# Altium project MicroLPR_DSP.PrjPcb
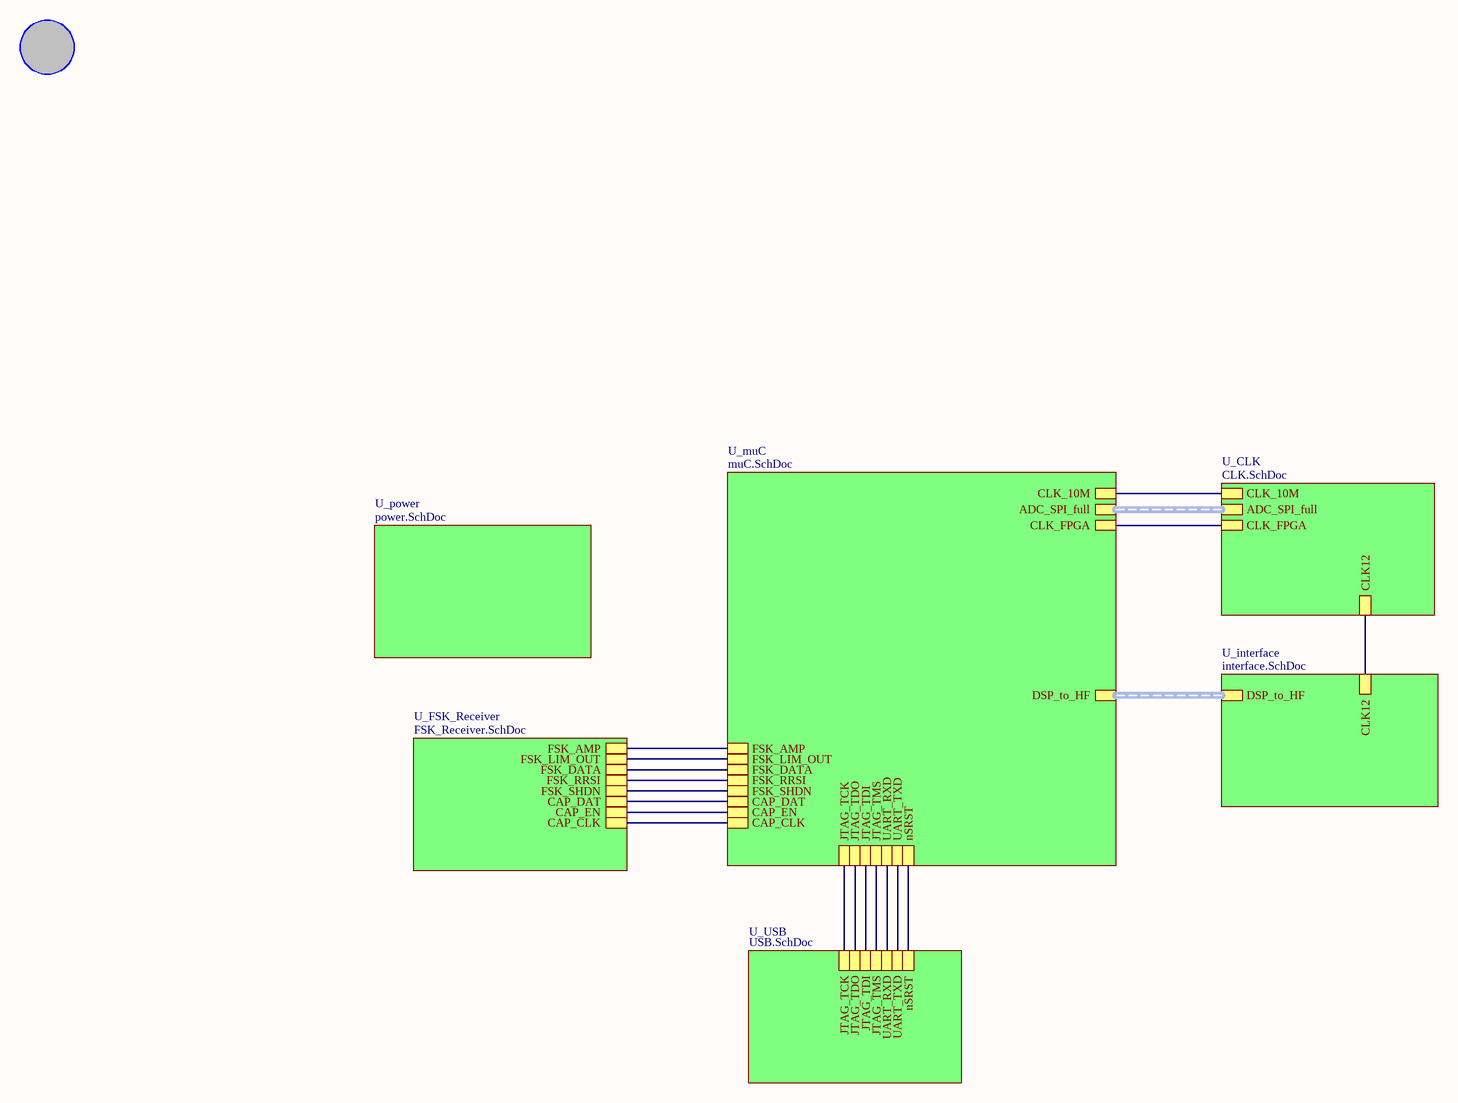
[diagram p0: toplvl.SchDoc]
Version: v1.11; PLB: PLB102241; Date: D705
7 sheets, 185 parts. Net scope: hierarchical (ports join the sheet entries above them; power ports are global).
Board file: MicroLPR_DSP.PcbDoc
Sheets:
  toplvl.SchDoc
    U_power = power.SchDoc
    U_interface = interface.SchDoc
    U_muC = muC.SchDoc
    U_USB = USB.SchDoc
    U_FSK_Receiver = FSK_Receiver.SchDoc
    U_CLK = CLK.SchDoc

## Sheet toplvl.SchDoc
size A3; DrawnBy: Matthias Gareis; Engineer: Matthias Gareis; DocumentNumber: 1; Revision: V0.0; SheetNumber: 1; SheetTotal: 5; VersionControl_RevNumber: 0_0; DocumentName: MicroLPR_DSP; ProjectName: 24GHZ Radar System

### Parts
H600  mounting_hole_3_5  [mounting_hole_3_2_rest_3_5]  (value not drawn)

### Sub-sheets
U_CLK = CLK.SchDoc: CLK_10M, ADC_SPI_full (harness ADC_SPI_full), CLK12, CLK_FPGA
U_FSK_Receiver = FSK_Receiver.SchDoc: FSK_AMP, FSK_LIM_OUT, FSK_DATA, FSK_RRSI, FSK_SHDN, CAP_DAT, CAP_EN, CAP_CLK
U_interface = interface.SchDoc: DSP_to_HF (harness DSP_to_HF), CLK12
U_muC = muC.SchDoc: CLK_10M, DSP_to_HF (harness DSP_to_HF), FSK_AMP, FSK_LIM_OUT, FSK_DATA, FSK_RRSI, FSK_SHDN, CAP_DAT, CAP_EN, ADC_SPI_full (harness ADC_SPI_full), CLK_FPGA, JTAG_TCK, JTAG_TDO, JTAG_TDI, JTAG_TMS, UART_RXD, UART_TXD, nSRST, CAP_CLK
U_power = power.SchDoc: no entries
U_USB = USB.SchDoc: JTAG_TCK, JTAG_TDO, JTAG_TDI, JTAG_TMS, UART_RXD, UART_TXD, nSRST

### Nets
CAP_CLK: sheet U_muC/CAP_CLK, sheet U_FSK_Receiver/CAP_CLK
CAP_DAT: sheet U_muC/CAP_DAT, sheet U_FSK_Receiver/CAP_DAT
CAP_EN: sheet U_muC/CAP_EN, sheet U_FSK_Receiver/CAP_EN
CLK_10MHz: sheet U_muC/CLK_10M, sheet U_CLK/CLK_10M
CLK_32MHz: sheet U_muC/CLK_FPGA, sheet U_CLK/CLK_FPGA
CLK_64MHz: sheet U_interface/CLK12, sheet U_CLK/CLK12
FSK_DATA: sheet U_muC/FSK_DATA, sheet U_FSK_Receiver/FSK_DATA
FSK_LIM_OUT: sheet U_muC/FSK_LIM_OUT, sheet U_FSK_Receiver/FSK_LIM_OUT
FSK_RRSI: sheet U_muC/FSK_RRSI, sheet U_FSK_Receiver/FSK_RRSI
FSK_SHDN: sheet U_muC/FSK_SHDN, sheet U_FSK_Receiver/FSK_SHDN
IFQ_50: sheet U_muC/FSK_AMP, sheet U_FSK_Receiver/FSK_AMP
JTAG_TCK: sheet U_muC/JTAG_TCK, sheet U_USB/JTAG_TCK
JTAG_TDI: sheet U_muC/JTAG_TDI, sheet U_USB/JTAG_TDI
JTAG_TDO: sheet U_muC/JTAG_TDO, sheet U_USB/JTAG_TDO
JTAG_TMS: sheet U_muC/JTAG_TMS, sheet U_USB/JTAG_TMS
nSRST: sheet U_muC/nSRST, sheet U_USB/nSRST
UART_RXD: sheet U_muC/UART_RXD, sheet U_USB/UART_RXD
UART_TXD: sheet U_muC/UART_TXD, sheet U_USB/UART_TXD

### Buses and harness runs
harness sheet U_CLK/ADC_SPI_full = sheet U_muC/ADC_SPI_full
harness sheet U_interface/DSP_to_HF = sheet U_muC/DSP_to_HF

## Sheet power.SchDoc
size A3; DocumentNumber: 2; SheetTotal: 4
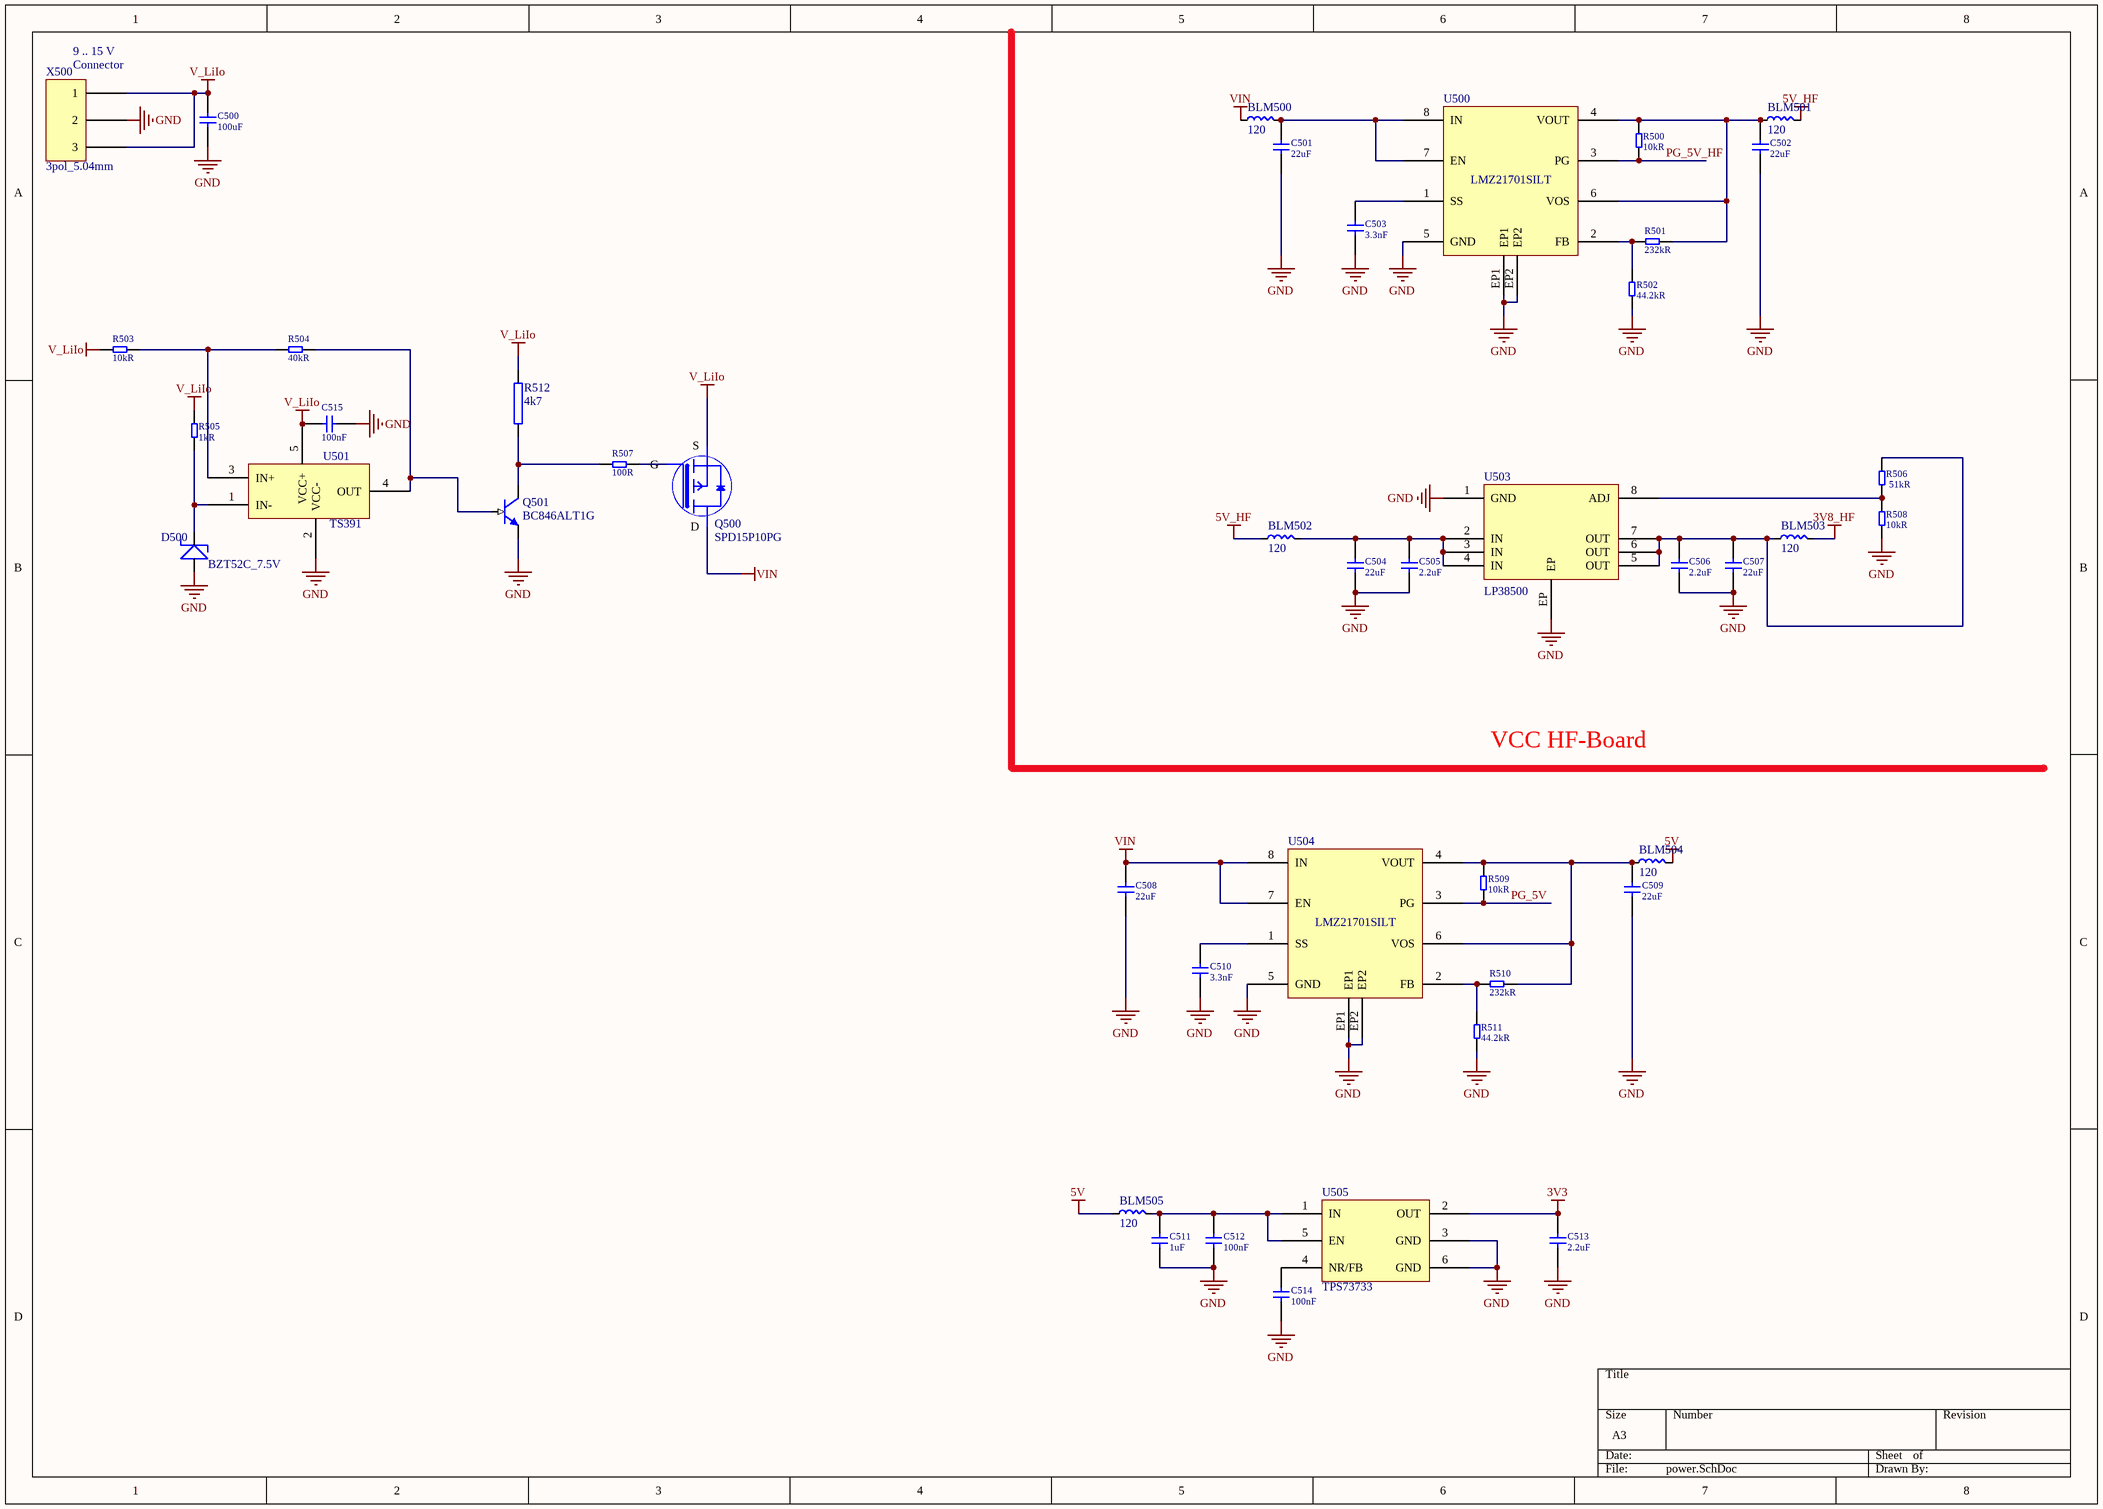
[diagram p1: power.SchDoc]

### Parts
BLM500  FerriteBeat  [BLM18SG121TN1]  (value not drawn)
BLM501  FerriteBeat  [BLM18SG121TN1]  (value not drawn)
BLM502  FerriteBeat  [BLM18SG121TN1]  (value not drawn)
BLM503  FerriteBeat  [BLM18SG121TN1]  (value not drawn)
BLM504  FerriteBeat  [BLM18SG121TN1]  (value not drawn)
BLM505  FerriteBeat  [BLM18SG121TN1]  (value not drawn)
C500  value 100uF  [C_SMD_1210]  (hidden comment: SMD capacitor)
C501  value 22uF  [C_SMD_0805]  (hidden comment: SMD capacitor)
C502  value 22uF  [C_SMD_0805]  (hidden comment: SMD capacitor)
C503  value 3.3nF  [C_SMD_0402]  (hidden comment: SMD capacitor)
C504  value 22uF  [C_SMD_0805]  (hidden comment: SMD capacitor)
C505  value 2.2uF  [C_SMD_0603]  (hidden comment: SMD capacitor)
C506  2.2uF  [C_SMD_0603]
C507  value 22uF  [C_SMD_0805]  (hidden comment: SMD capacitor)
C508  value 22uF  [C_SMD_0805]  (hidden comment: SMD capacitor)
C509  value 22uF  [C_SMD_0805]  (hidden comment: SMD capacitor)
C510  value 3.3nF  [C_SMD_0402]  (hidden comment: SMD capacitor)
C511  value 1uF  [C_SMD_0603]  (hidden comment: SMD capacitor)
C512  value 100nF  [C_SMD_0402]  (hidden comment: SMD capacitor)
C513  value 2.2uF  [C_SMD_0603]  (hidden comment: SMD capacitor)
C514  value 100nF  [C_SMD_0402]  (hidden comment: SMD capacitor)
C515  value 100nF  [C_SMD_0402]  (hidden comment: SMD capacitor)
D500  BZT52C_7.5V  [SOD-323]
Q500  SPD15P10PG  [PG-TO-252-3]
Q501  BC846ALT1G  [SOT-23_BCE]
R500  value 10kR  [R_SMD_0402]  (hidden comment: SMD Resistor)
R501  value 232kR  [R_SMD_0402]  (hidden comment: SMD Resistor)
R502  value 44.2kR  [R_SMD_0402]  (hidden comment: SMD Resistor)
R503  value 10kR  [R_SMD_0402]  (hidden comment: SMD Resistor)
R504  value 40kR  [R_SMD_0402]  (hidden comment: SMD Resistor)
R505  value 1kR  [R_SMD_0402]  (hidden comment: SMD Resistor)
R506  51kR  [R_SMD_0402]
R507  value 100R  [R_SMD_0402]  (hidden comment: SMD Resistor)
R508  10kR  [R_SMD_0402]
R509  value 10kR  [R_SMD_0402]  (hidden comment: SMD Resistor)
R510  value 232kR  [R_SMD_0402]  (hidden comment: SMD Resistor)
R511  value 44.2kR  [R_SMD_0402]  (hidden comment: SMD Resistor)
R512  4k7  [0402RN]
U500  LMZ21701SILT  [LMZ21701]
U501  TS391  [SOT-23-5]
U503  LP38500  [LP38500]
U504  LMZ21701SILT  [LMZ21701]
U505  TPS73733  [SOT-223-6]
X500  3pol_5.04mm  [POWER_CON]

### Nets
3V3: C513.1 U505.2(OUT)
3V8_HF: BLM503.1
5V: BLM504.1 BLM505.2
5V_HF: BLM501.1 BLM502.2
GND: C500.2 C501.2 C502.2 C503.2 C504.2 C505.2 C506.1 C507.1 C508.2 C509.2 C510.2 C511.2 C512.2 C513.2 C514.2 C515.2 D500.2 Q501.E R502.2 R508.2 R511.2 U500.5(GND) U500.EP1 U500.EP2 U501.2(VCC-) U503.1(GND) U503.EP U504.5(GND) U504.EP1 U504.EP2 U505.3(GND) U505.6(GND) X500.2
V_LiIo: C500.1 C515.1 Q500.3(S) R503.1 R505.1 R512.2 U501.5(VCC+) X500.1 X500.3
VIN: BLM500.2 C508.1 Q500.2(D) U504.7(EN) U504.8(IN)
PG_5V: R509.2 U504.3(PG)
PG_5V_HF: R500.2 U500.3(PG)
NetBLM500_1: BLM500.1 C501.1 U500.7(EN) U500.8(IN)
NetBLM501_2: BLM501.2 C502.1 R500.1 R501.2 U500.4(VOUT) U500.6(VOS)
NetBLM502_1: BLM502.1 C504.1 C505.1 U503.2(IN) U503.3(IN) U503.4(IN)
NetBLM503_2: BLM503.2 C506.2 C507.2 R506.1 U503.5(OUT) U503.6(OUT) U503.7(OUT)
NetBLM504_2: BLM504.2 C509.1 R509.1 R510.2 U504.4(VOUT) U504.6(VOS)
NetBLM505_1: BLM505.1 C511.1 C512.1 U505.1(IN) U505.5(EN)
NetC503_1: C503.1 U500.1(SS)
NetC510_1: C510.1 U504.1(SS)
NetC514_1: C514.1 U505.4(NR/FB)
NetD500_1: D500.1 R505.2 U501.1(IN-)
NetQ500_1: Q500.1(G) R507.1
NetQ501_B: Q501.B R504.2 U501.4(OUT)
NetQ501_C: Q501.C R507.2 R512.1
NetR501_1: R501.1 R502.1 U500.2(FB)
NetR503_2: R503.2 R504.1 U501.3(IN+)
NetR506_2: R506.2 R508.1 U503.8(ADJ)
NetR510_1: R510.1 R511.1 U504.2(FB)

### Notes on the sheet
- (near X500) 9 .. 15 V
- (near X500) Connector
- VCC HF-Board
- (in symbol FerriteBeat) 120

### Library data of the parts
BLM500-BLM505 = FerriteBeat: BLM18SG121TN1; Link: http://www.murata.com/en-us/api/pdfdownloadapi?cate=luNoiseSupprFilteChipFerriBead&partno=BLM18SG121TN1%23
C500 = C_SMD: 100uF, 1210, 25V, 20%, X5R; Type: X5R; Voltage Rate: *
C501 C508 = C_SMD: 22uF, 0805, 25V, 20%, X5R; Voltage Rate: 10V; Type: X5R
C502 C504 C507 C509 = C_SMD: 22uF, 0805, 10V, 20%, X5R; Type: X5R; Voltage Rate: 10V
C503 C510 = C_SMD: 3.3nF, 0402, 10V, 10%, X5R; Type: X5R; Voltage Rate: 10V
C505 C506 C513 = C_SMD: 2.2uF, 0603, 6.3V, 10%, X5R; Type: X5R; Voltage Rate: *
  C506: Value: 2.2uF
C511 = C_SMD: 1uF, 0603, 6.3V, 10%, X5R; Type: X5R; Voltage Rate: *
C512 C514 C515 = C_SMD: 100nF, 0402, 6.3V, 10%, X5R; Type: X5R; Voltage Rate: *
D500 = BZT52C: BZT52C7V5S-7-F
Q500 = SPD15P10PG: SPD15P10PGBTMA1, MOSFET P-CH 100V 15A TO252-3
Q501 = npn-Transistor - BC846ALT1G: BC846A; Ic 100mA; Uce 65V; NPN Transistor; Typ: Bipolartranistor Leistung; FIT: 3; Libary Name: bjt.SchLib; Hersteller: Semiconductor; Bauteilalternative: Diodes Inc: BC846A-7-F; DatenblattLink intern: O:\literature\datasheets\nxp\transistoren\MMBT3904\MMBT3904.pdf; Eingetragen von: MK; Part Number: npn-Transistor - BC846ALT1G; Source: SN29500-3, Tab. 1; Footprint Name: SOT-23.PcbLib; Footprint: SOT23; Bauteilenummer: BC846ALT1G; quantity Multiplier: 1; HelpURL: http://www.onsemi.com/pub_link/Collateral/BC846ALT1-D.PDF; DatenblattLink: http://www.onsemi.com/pub_link/Collateral/BC846ALT1-D.PDF; Distributor1: Digikey; Teilenummer Distributor1: BC846ALT1GOSCT-ND; Preis @100 Distributor1: 0,0837; Distributor2: Mouser; Teilenummer Distributor2: 863-BC846ALT1G; Preis @100 Distributor2: 0,04; Distributor3: Farnell; Teilenummer Distributor3: 1459036; Preis @100 Distributor3: 0,069
R500 R509 = R_SMD: 10kR, 0402, 1%
R501 R510 = R_SMD: 232kR, 0402, 1%
R502 R511 = R_SMD: 44.2kR, 0402, 1%
R503 = R_SMD: 10kR, 04020 ,1%
R504 = R_SMD: 40kR, 04020 ,1%
R505 = R_SMD: 1kR, 04020 ,1%
R506 = R_SMD: 43.2kR, 0402, 1%; Value: 51kR
R507 = R_SMD: 100R, 04020 ,1%
R508 = R_SMD: 8.25kR, 0402, 1%; Value: 10kR
R512 = 4k7, 0402, 1%, 0.063W, 50V: 1%, 0.063W, 50V, 0402; Typ: Widerstand Metallschicht; FIT: 0,2; Libary Name: _RES.Schlib; Eingetragen von: MK; Part Number: 4k7, 0402, 1%, 0.063W, 50V; Source: SN29500-4, Tabelle 2; Footprint Name: 0402RN.Pcblib; Footprint: 0402; quantity Multiplier: 1; Distributor1: Digikey; Preis @100 Distributor1: 0,0056
U500 U504 = LMZ21701
U501 = TS391: TS391RILT,   Comparator General Purpose TTL, DTL, ECL, MOS, CMOS SOT-23-5
U503 = LP38500: LP38502ASD-ADJ/NOPB
U505 = TPS73733: TPS73733DCQR
X500 = CON_5.04_3pol: 3 polig, 5.04mm pitch

## Sheet interface.SchDoc
size A3; DocumentNumber: 3; SheetTotal: 4
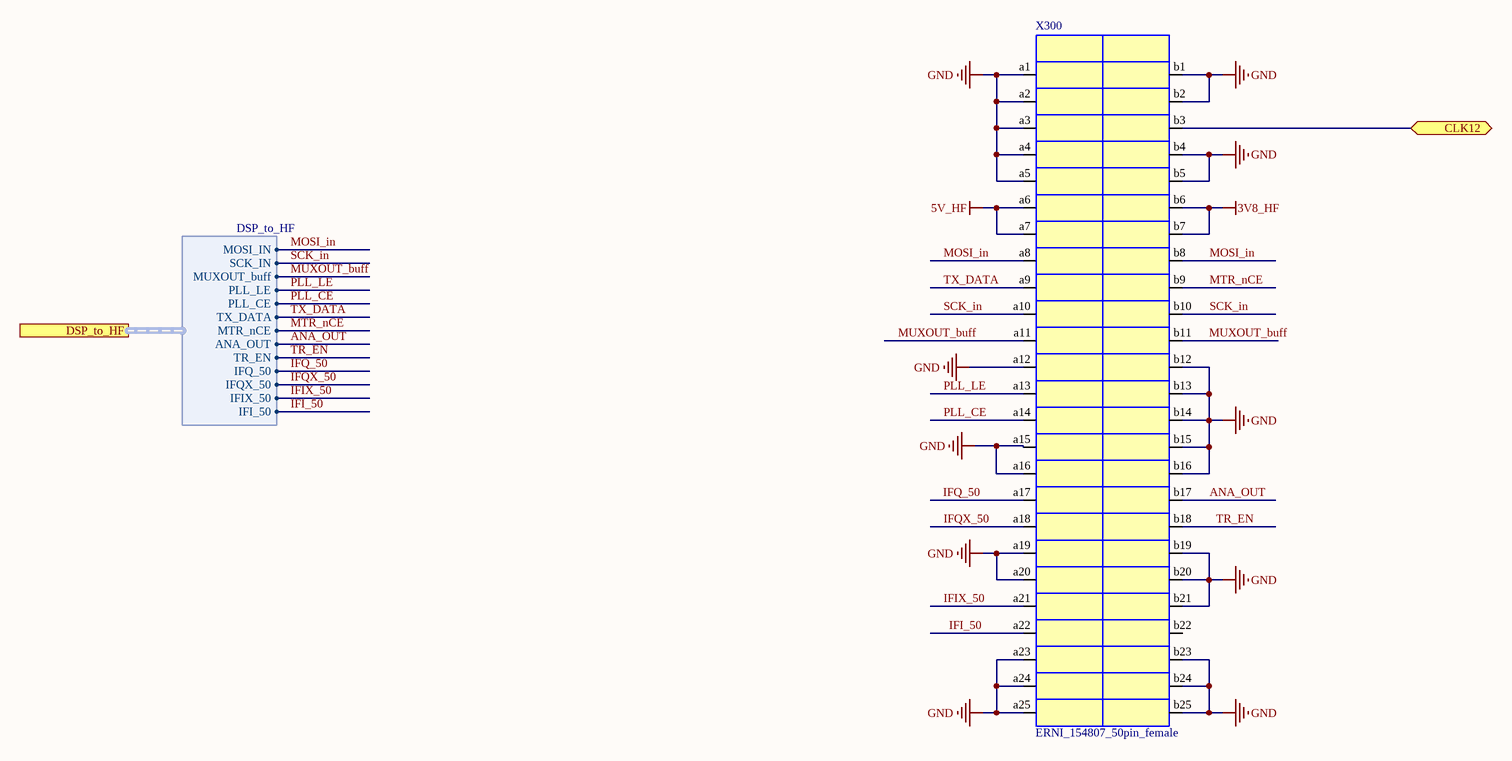
[diagram p2: interface.SchDoc]

### Parts
X300  ERNI_154807_50pin_female  [ERNI_SMC_50_PINM]

### Ports
CLK12 (bidir), DSP_to_HF (harness DSP_to_HF)

### Harnesses
DSP_to_HF: MOSI_IN, SCK_IN, MUXOUT_buff, PLL_LE, PLL_CE, TX_DATA, MTR_nCE, ANA_OUT, TR_EN, IFQ_50, IFQX_50, IFIX_50, IFI_50

### Nets
3V8_HF: X300.b6 X300.b7
5V_HF: X300.a6 X300.a7
GND: X300.a1 X300.a2 X300.a3 X300.a4 X300.a5 X300.a12 X300.a15 X300.a16 X300.a19 X300.a20 X300.a23 X300.a24 X300.a25 X300.b1 X300.b2 X300.b4 X300.b5 X300.b12 X300.b13 X300.b14 X300.b15 X300.b16 X300.b19 X300.b20 X300.b21 X300.b23 X300.b24 X300.b25
ANA_OUT: X300.b17 ; port DSP_to_HF.ANA_OUT
CLK_64MHz: X300.b3 ; port CLK12
IFI_50: X300.a22 ; port DSP_to_HF.IFI_50
IFIX_50: X300.a21 ; port DSP_to_HF.IFIX_50
IFQ_50: X300.a17 ; port DSP_to_HF.IFQ_50
IFQX_50: X300.a18 ; port DSP_to_HF.IFQX_50
MOSI_in: X300.a8 X300.b8 ; port DSP_to_HF.MOSI_IN
MTR_nCE: X300.b9 ; port DSP_to_HF.MTR_nCE
MUXOUT_buff: X300.a11 X300.b11 ; port DSP_to_HF.MUXOUT_buff
PLL_CE: X300.a14 ; port DSP_to_HF.PLL_CE
PLL_LE: X300.a13 ; port DSP_to_HF.PLL_LE
SCK_in: X300.a10 X300.b10 ; port DSP_to_HF.SCK_IN
TR_EN: X300.b18 ; port DSP_to_HF.TR_EN
TX_DATA: X300.a9 ; port DSP_to_HF.TX_DATA

Not connected (* = marked no-connect by the designer): X300 b22

## Sheet muC.SchDoc
size A3; Organization: asdf; Address1: asdf; Revision: 1
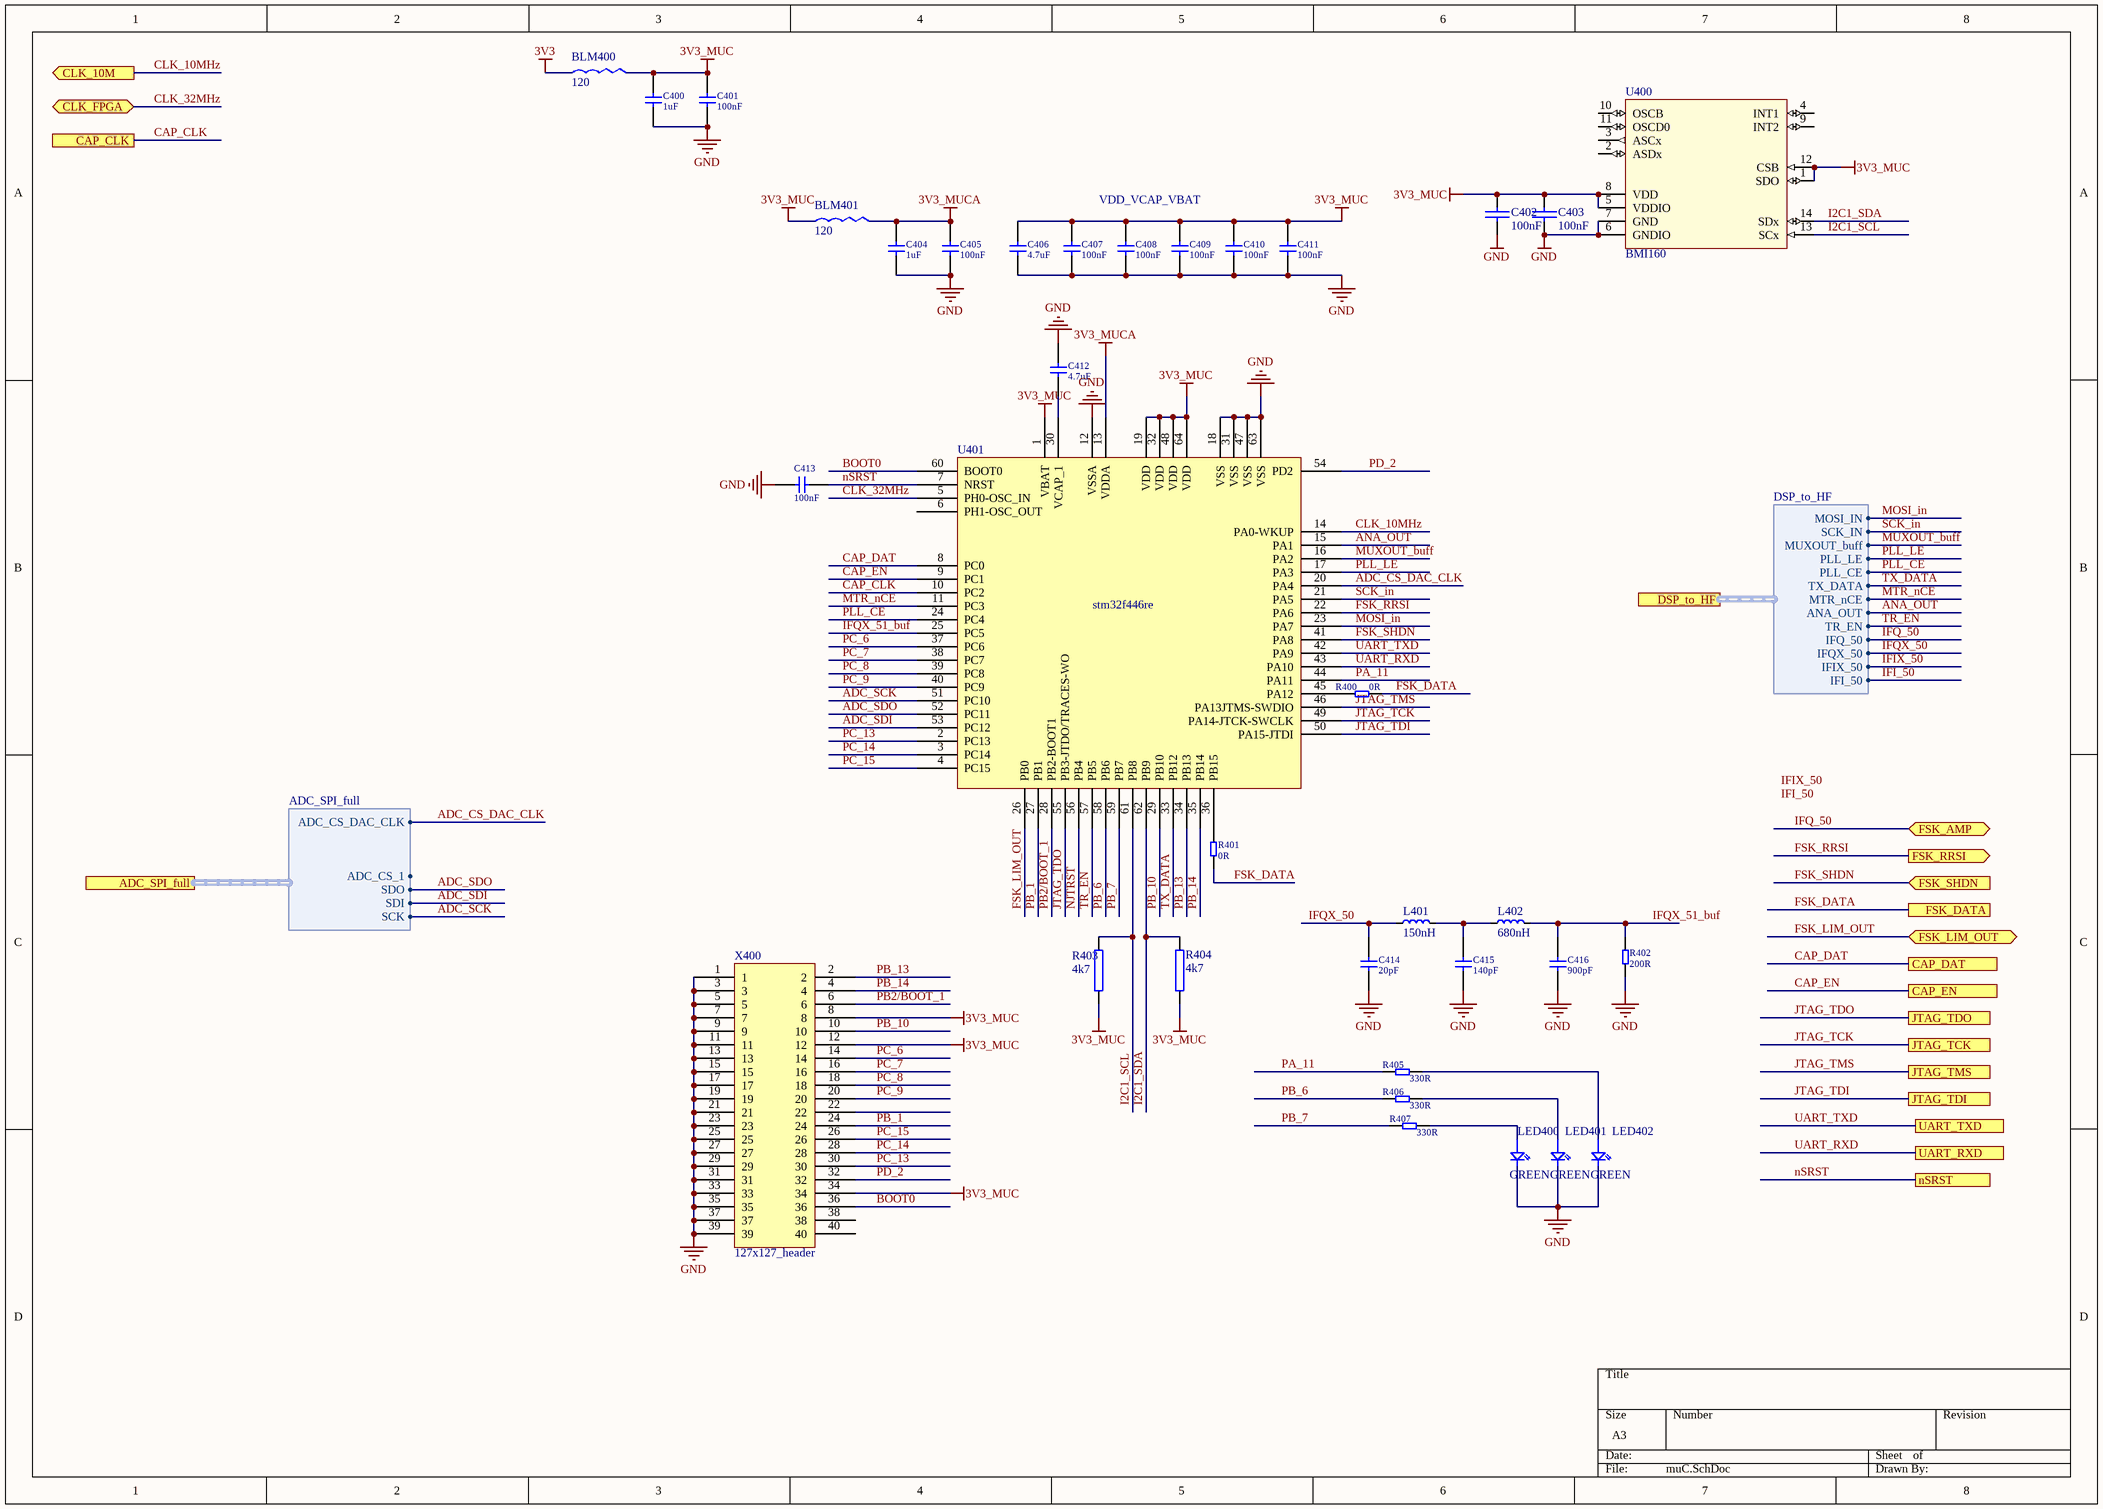
[diagram p3: muC.SchDoc]

### Parts
BLM400  FerriteBeat  [BLM18SG121TN1]  (value not drawn)
BLM401  FerriteBeat  [BLM18SG121TN1]  (value not drawn)
C400  value 1uF  [C_SMD_0603]  (hidden comment: SMD capacitor)
C401  value 100nF  [C_SMD_0402]  (hidden comment: SMD capacitor)
C402  100nF  [0402RN]
C403  100nF  [0402RN]
C404  value 1uF  [C_SMD_0603]  (hidden comment: SMD capacitor)
C405  value 100nF  [C_SMD_0402]  (hidden comment: SMD capacitor)
C406  value 4.7uF  [C_SMD_0603]  (hidden comment: SMD capacitor)
C407  value 100nF  [C_SMD_0402]  (hidden comment: SMD capacitor)
C408  value 100nF  [C_SMD_0402]  (hidden comment: SMD capacitor)
C409  value 100nF  [C_SMD_0402]  (hidden comment: SMD capacitor)
C410  value 100nF  [C_SMD_0402]  (hidden comment: SMD capacitor)
C411  value 100nF  [C_SMD_0402]  (hidden comment: SMD capacitor)
C412  value 4.7uF  [C_SMD_0603]  (hidden comment: SMD capacitor)
C413  value 100nF  [C_SMD_0402]  (hidden comment: SMD capacitor)
C414  value 20pF  [C_SMD_0402]  (hidden comment: SMD capacitor)
C415  value 140pF  [C_SMD_0402]  (hidden comment: SMD capacitor)
C416  value 900pF  [C_SMD_0402]  (hidden comment: SMD capacitor)
L401  150nH  [L_0805]
L402  680nH  [L_0805]
LED400  KPHHS-1005  [R_SMD_0402]  (value not drawn)
LED401  KPHHS-1005  [R_SMD_0402]  (value not drawn)
LED402  KPHHS-1005  [R_SMD_0402]  (value not drawn)
R400  value 0R  [R_SMD_0402]  (hidden comment: SMD Resistor)
R401  value 0R  [R_SMD_0402]  (hidden comment: SMD Resistor)
R402  value 200R  [R_SMD_0402]  (hidden comment: SMD Resistor)
R403  4k7  [0402RN]
R404  4k7  [0402RN]
R405  value 330R  [R_SMD_0402]  (hidden comment: SMD Resistor)
R406  value 330R  [R_SMD_0402]  (hidden comment: SMD Resistor)
R407  value 330R  [R_SMD_0402]  (hidden comment: SMD Resistor)
U400  BMI160  [BMI160]
U401  stm32f446re  [LQFP64]
X400  127x127_header  [Header_127x127_40PIN]

### Ports
ADC_SPI_full (harness ADC_SPI_full), CAP_CLK, CAP_DAT, CAP_EN, CLK_10M (out), CLK_FPGA (bidir), DSP_to_HF (harness DSP_to_HF), FSK_AMP (bidir), FSK_DATA, FSK_LIM_OUT (bidir), FSK_RRSI (out), FSK_SHDN (in), JTAG_TCK, JTAG_TDI, JTAG_TDO, JTAG_TMS, nSRST, UART_RXD, UART_TXD

### Harnesses
DSP_to_HF: MOSI_IN, SCK_IN, MUXOUT_buff, PLL_LE, PLL_CE, TX_DATA, MTR_nCE, ANA_OUT, TR_EN, IFQ_50, IFQX_50, IFIX_50, IFI_50
ADC_SPI_full: ADC_CS_1, SDO, SDI, SCK, ADC_CS_DAC_CLK

### Nets
3V3: BLM400.1
3V3_MUC: BLM400.2 BLM401.1 C400.1 C401.1 C402.1 C403.1 C406.1 C407.1 C408.1 C409.1 C410.1 C411.1 R403.1 R404.1 U400.1(SDO) U400.5(VDDIO) U400.8(VDD) U400.12(CSB) U401.1(VBAT) U401.19(VDD) U401.32(VDD) U401.48(VDD) U401.64(VDD) X400.8 X400.12 X400.34
3V3_MUCA: BLM401.2 C404.1 C405.1 U401.13(VDDA)
GND: C400.2 C401.2 C402.2 C403.2 C404.2 C405.2 C406.2 C407.2 C408.2 C409.2 C410.2 C411.2 C412.2 C413.2 C414.2 C415.2 C416.2 LED400.2 LED401.2 LED402.2 R402.2 U400.6(GNDIO) U400.7(GND) U401.12(VSSA) U401.18(VSS) U401.31(VSS) U401.47(VSS) U401.63(VSS) X400.1 X400.3 X400.5 X400.7 X400.9 X400.11 X400.13 X400.15 X400.17 X400.19 X400.21 X400.23 X400.25 X400.27 X400.29 X400.31 X400.33 X400.35 X400.37 X400.39
ADC_CS_DAC_CLK: U401.20(PA4) ; port ADC_SPI_full.ADC_CS_DAC_CLK
ADC_SCK: U401.51(PC10) ; port ADC_SPI_full.SCK
ADC_SDI: U401.53(PC12) ; port ADC_SPI_full.SDI
ADC_SDO: U401.52(PC11) ; port ADC_SPI_full.SDO
ANA_OUT: U401.15(PA1) ; port DSP_to_HF.ANA_OUT
BOOT0: U401.60(BOOT0) X400.36
CAP_CLK: U401.10(PC2) ; port CAP_CLK
CAP_DAT: U401.8(PC0) ; port CAP_DAT
CAP_EN: U401.9(PC1) ; port CAP_EN
CLK_10MHz: U401.14(PA0-WKUP) ; port CLK_10M
CLK_32MHz: U401.5(PH0-OSC_IN) ; port CLK_FPGA
FSK_DATA: R400.1 R401.2 ; port FSK_DATA
FSK_LIM_OUT: U401.26(PB0) ; port FSK_LIM_OUT
FSK_RRSI: U401.22(PA6) ; port FSK_RRSI
FSK_SHDN: U401.41(PA8) ; port FSK_SHDN
I2C1_SCL: R403.2 U400.13(SCx) U401.61(PB8)
I2C1_SDA: R404.2 U400.14(SDx) U401.62(PB9)
IFQ_50: port FSK_AMP, port DSP_to_HF.IFQ_50
IFQX_50: C414.1 L401.2 ; port DSP_to_HF.IFQX_50
IFQX_51_buf: C416.1 L402.1 R402.1 U401.25(PC5)
JTAG_TCK: U401.49(PA14-JTCK-SWCLK) ; port JTAG_TCK
JTAG_TDI: U401.50(PA15-JTDI) ; port JTAG_TDI
JTAG_TDO: U401.55(PB3-JTDO/TRACES-WO) ; port JTAG_TDO
JTAG_TMS: U401.46(PA13JTMS-SWDIO) ; port JTAG_TMS
MOSI_in: U401.23(PA7) ; port DSP_to_HF.MOSI_IN
MTR_nCE: U401.11(PC3) ; port DSP_to_HF.MTR_nCE
MUXOUT_buff: U401.16(PA2) ; port DSP_to_HF.MUXOUT_buff
NJTRST: U401.56(PB4)
nSRST: C413.1 U401.7(NRST) ; port nSRST
PA_11: R405.1 U401.44(PA11)
PB2/BOOT_1: U401.28(PB2-BOOT1) X400.6
PB_1: U401.27(PB1) X400.24
PB_6: R406.1 U401.58(PB6)
PB_7: R407.1 U401.59(PB7)
PB_10: U401.29(PB10) X400.10
PB_13: U401.34(PB13) X400.2
PB_14: U401.35(PB14) X400.4
PC_6: U401.37(PC6) X400.14
PC_7: U401.38(PC7) X400.16
PC_8: U401.39(PC8) X400.18
PC_9: U401.40(PC9) X400.20
PC_13: U401.2(PC13) X400.30
PC_14: U401.3(PC14) X400.28
PC_15: U401.4(PC15) X400.26
PD_2: U401.54(PD2) X400.32
PLL_CE: U401.24(PC4) ; port DSP_to_HF.PLL_CE
PLL_LE: U401.17(PA3) ; port DSP_to_HF.PLL_LE
SCK_in: U401.21(PA5) ; port DSP_to_HF.SCK_IN
TR_EN: U401.57(PB5) ; port DSP_to_HF.TR_EN
TX_DATA: U401.33(PB12) ; port DSP_to_HF.TX_DATA
UART_RXD: U401.43(PA10) ; port UART_RXD
UART_TXD: U401.42(PA9) ; port UART_TXD
NetC412_1: C412.1 U401.30(VCAP_1)
NetC415_1: C415.1 L401.1 L402.2
NetLED400_1: LED400.1 R407.2
NetLED401_1: LED401.1 R406.2
NetLED402_1: LED402.1 R405.2
NetR400_2: R400.2 U401.45(PA12)
NetR401_1: R401.1 U401.36(PB15)

Not connected (* = marked no-connect by the designer): U400 2(ASDx) 3(ASCx) 4(INT1) 9(INT2) 10(OSCB) 11(OSCD0); U401 6(PH1-OSC_OUT); X400 22 38 40

### Notes on the sheet
- VDD_VCAP_VBAT
- Labels drawn without touching a wire or pin: IFI_50, IFIX_50
- (in symbol FerriteBeat) 120
- (in symbol KPHHS-1005) GREEN

### Library data of the parts
BLM400 BLM401 = FerriteBeat: BLM18SG121TN1; Link: http://www.murata.com/en-us/api/pdfdownloadapi?cate=luNoiseSupprFilteChipFerriBead&partno=BLM18SG121TN1%23
C400 C404 = C_SMD: 1uF, 0603, 6.3V, 10%, X5R; Type: X5R; Voltage Rate: *
C401 C405 C407-C411 C413 = C_SMD: 100nF, 0402, 6.3V, 10%, X5R; Type: X5R; Voltage Rate: *
C402 C403 = 100n, 0402, 16V, X7R, 5%: MLCC, X7R, 16V, 5%, 0402; Libary Name: _CAP.Schlib; Hersteller: Kemet; Bauteilenummer: C0402C104J4RACTU; Bauteilalternative: with same specifications; Part Number: 100n, 0402, 16V, X7R, 5%; Footprint Name: 0402RN.PcbLib; Footprint: 0402; quantity Multiplier: 1; Distributor1: Digikey; Teilenummer Distributor1: 399-7761-1-ND; Preis @100 Distributor1: 0,153
C406 C412 = C_SMD: 4.7uF, 0603, 6.3V, 10%, X5R; Type: X5R; Voltage Rate: *
C414 = C_SMD: 20pF, 0402, 6.3V, 10%, X5R; Type: X5R; Voltage Rate: 6.3V
C415 = C_SMD: 140pF, 0402, 6.3V, 10%, X5R; Type: X5R; Voltage Rate: 6.3V
C416 = C_SMD: 900pF, 0402, 6.3V, 10%, X5R; Type: X5R; Voltage Rate: 6.3V
L401 = 744761215A: 744761215A,150nH Inductor, Würth Elektorn
L402 = 744761268A: 744761268A, 680nH
R400 R401 = R_SMD: 0R,0402
R402 = R_SMD: 200R, 0402, 1%
R403 R404 = 4k7, 0402, 1%, 0.063W, 50V: 1%, 0.063W, 50V, 0402; Libary Name: _RES.Schlib; Part Number: 4k7, 0402, 1%, 0.063W, 50V; Footprint Name: 0402RN.Pcblib; Footprint: 0402; quantity Multiplier: 1; Distributor1: Digikey; Preis @100 Distributor1: 0,0056
R405-R407 = R_SMD: 330R, 0402, 1%
U400 = Sensor BMI160: Bosch Accelerometer and Gyro; I2C & SPI; Libary Name: bosch.SchLib; Part Number: Sensor BMI160; Footprint Name: bosch.PcbLib; Footprint: BMI!60; Hersteller: Bosch; Bauteilenummer: BMI160; quantity Multiplier: 1; DatenblattLink: https://ae-bst.resource.bosch.com/media/_tech/media/datasheets/BST-BMI160-DS000-07.pdf; Distributor1: Digikey; Teilenummer Distributor1: 828-1057-1-ND; Preis @100 Distributor1: 1,3; Distributor2: Mouser; Teilenummer Distributor2: 262-BMI160; Preis @100 Distributor2: 2,46
U401 = stm32f446re: 32uC; OrderingNumber: STM32F446RET6; HelpURL: http://www.st.com/content/st_com/en/products/microcontrollers/stm32-32-bit-arm-cortex-mcus/stm32f4-series/stm32f446/stm32f446re.html
X400 = Header_2x20_127mm: 127x127_header_throughole, 2x20
LED400-LED402 = KPHHS-1005: Link: http://datasheet.octopart.com/KPHHS1005SURCK-Kingbright-datasheet-10853925.pdf

## Sheet USB.SchDoc
size A3
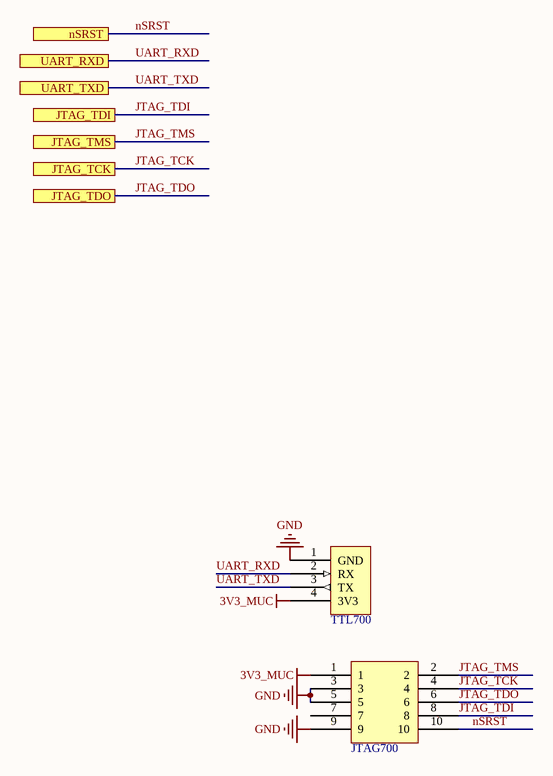
[diagram p4: USB.SchDoc]

### Parts
JTAG700  SHF-105-01-L-D-TH  [SHF-105-01-L-D-TH]  (value not drawn)
TTL700  RS232 Conector TTL  [HDR1X4]  (value not drawn)

### Ports
JTAG_TCK, JTAG_TDI, JTAG_TDO, JTAG_TMS, nSRST, UART_RXD, UART_TXD

### Nets
3V3_MUC: JTAG700.1 TTL700.4(3V3)
GND: JTAG700.3 JTAG700.5 JTAG700.9 TTL700.1(GND)
JTAG_TCK: JTAG700.4 ; port JTAG_TCK
JTAG_TDI: JTAG700.8 ; port JTAG_TDI
JTAG_TDO: JTAG700.6 ; port JTAG_TDO
JTAG_TMS: JTAG700.2 ; port JTAG_TMS
nSRST: JTAG700.10 ; port nSRST
UART_RXD: TTL700.2(RX) ; port UART_RXD
UART_TXD: TTL700.3(TX) ; port UART_TXD

Not connected (* = marked no-connect by the designer): JTAG700 7

### Library data of the parts
JTAG700 = Samtec SHF-105-01-L-D-TH: Samtex 2x5pol; THT 1.27mm; Libary Name: Samtec_Connector.SchLib; Hersteller: Samtec; Part Number: Samtec SHF-105-01-L-D-TH; Footprint Name: SAMTEC_CONNECTORS.PcbLib; Bauteilenummer: SHF-105-01-L-D-TH; quantity Multiplier: 1; Distributor1: Farnell; Teilenummer Distributor1: 1885915; Preis @100 Distributor1: 1,62
TTL700 = Connector - RS232 Conector TTL powered: Stiftleiste; RM:2.54mm; 4 polig einreihig, powered; Libary Name: RS232.SchLib; Hersteller: FCI; Bauteilenummer: 68002-404HLF; Bauteilalternative: oder vergleichbare mechanische Abmessung; Part Number: Connector - RS232 Conector TTL powered; Footprint Name: Miscellaneous Connectors.PcbLib; Footprint: HDR1x4-2.54; quantity Multiplier: 1; HelpURL: http://portal.fciconnect.com/res/en/pdffiles/doc_search//68000.pdf; DatenblattLink: http://portal.fciconnect.com/res/en/pdffiles/doc_search//68000.pdf; Distributor1: digikey; Teilenummer Distributor1: 609-3305-ND; Preis @100 Distributor1: 0,0937; Distributor2: Mouser; Teilenummer Distributor2: 649-68002-404HLF; Preis @100 Distributor2: 0,07

## Sheet FSK_Receiver.SchDoc
size A4
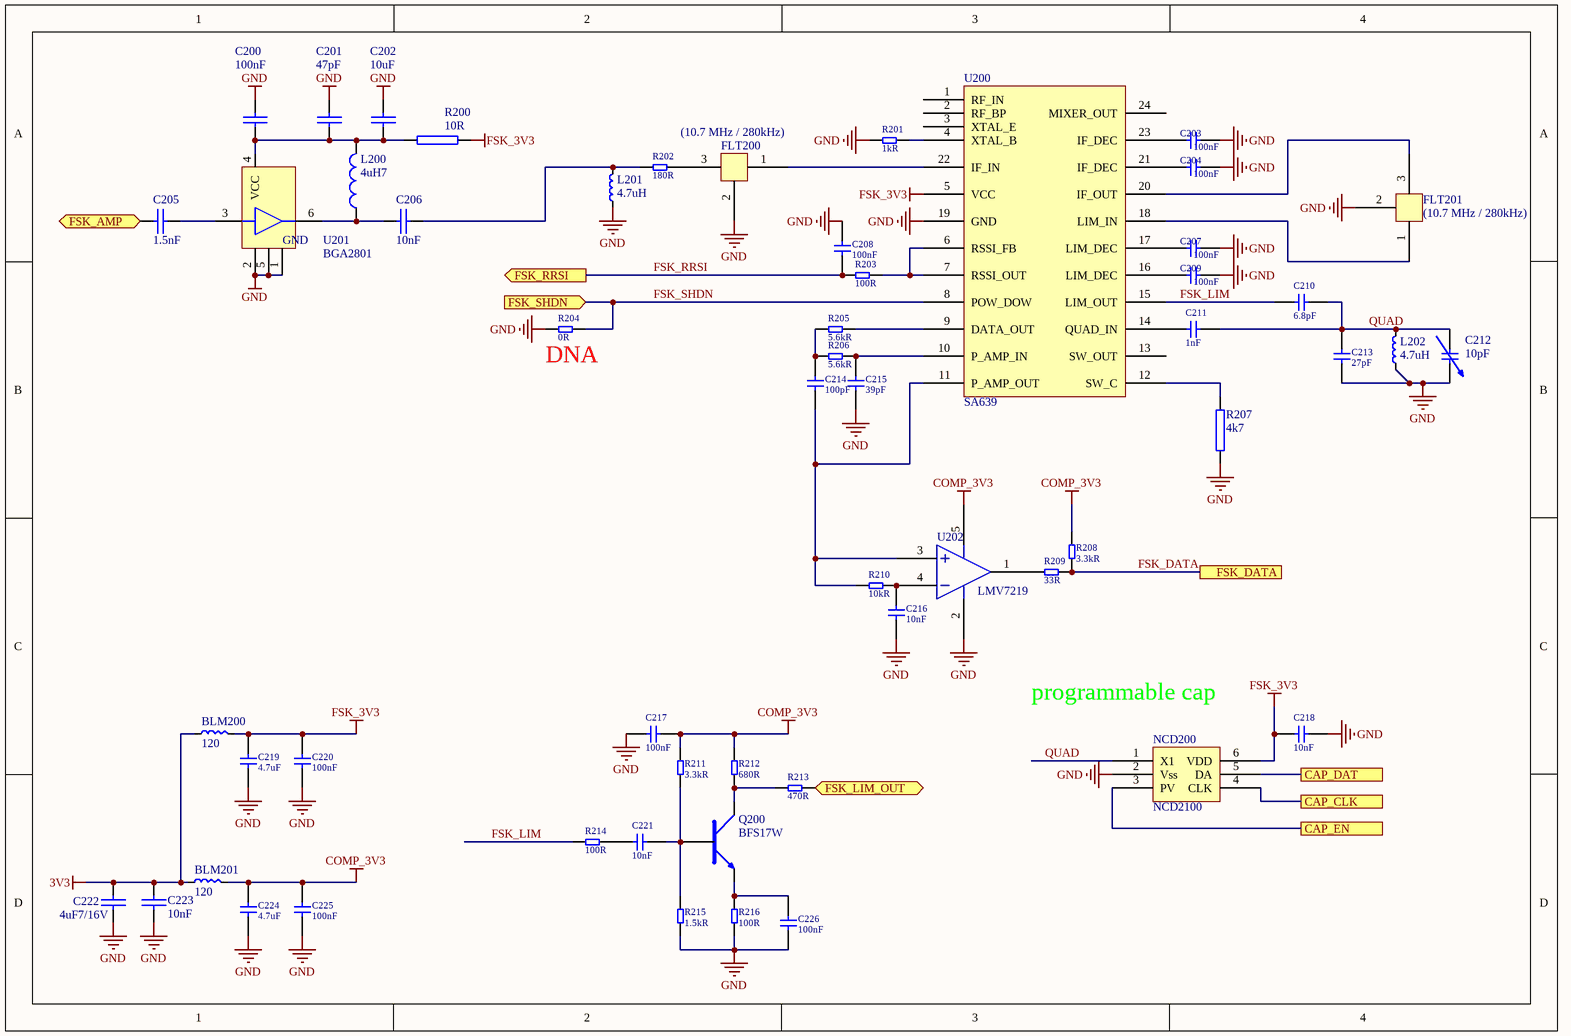
[diagram p5: FSK_Receiver.SchDoc]

### Parts
BLM200  FerriteBeat  [BLM18SG121TN1]  (value not drawn)
BLM201  FerriteBeat  [BLM18SG121TN1]  (value not drawn)
C200  100nF  [0402RN]
C201  47pF  [0402RN]
C202  10uF  [0603R]
C203  value 100nF  [C_SMD_0402]  (hidden comment: SMD capacitor)
C204  value 100nF  [C_SMD_0402]  (hidden comment: SMD capacitor)
C205  1.5nF  [0402RN]
C206  10nF  [0402RN]
C207  value 100nF  [C_SMD_0402]  (hidden comment: SMD capacitor)
C208  value 100nF  [C_SMD_0402]  (hidden comment: SMD capacitor)
C209  value 100nF  [C_SMD_0402]  (hidden comment: SMD capacitor)
C210  value 6.8pF  [C_SMD_0402]  (hidden comment: SMD capacitor)
C211  value 1nF  [C_SMD_0402]  (hidden comment: SMD capacitor)
C212  10pF  [TZC03]
C213  value 27pF  [C_SMD_0402]  (hidden comment: SMD capacitor)
C214  value 100pF  [C_SMD_0402]  (hidden comment: SMD capacitor)
C215  value 39pF  [C_SMD_0402]  (hidden comment: SMD capacitor)
C216  value 10nF  [C_SMD_0402]  (hidden comment: SMD capacitor)
C217  value 100nF  [C_SMD_0402]  (hidden comment: SMD capacitor)
C218  value 10nF  [C_SMD_0402]  (hidden comment: SMD capacitor)
C219  value 4.7uF  [C_SMD_0603]  (hidden comment: SMD capacitor)
C220  value 100nF  [C_SMD_0402]  (hidden comment: SMD capacitor)
C221  value 10nF  [C_SMD_0402]  (hidden comment: SMD capacitor)
C222  4uF7/16V  [1206R]
C223  10nF  [0402RN]
C224  value 4.7uF  [C_SMD_0603]  (hidden comment: SMD capacitor)
C225  value 100nF  [C_SMD_0402]  (hidden comment: SMD capacitor)
C226  value 100nF  [C_SMD_0402]  (hidden comment: SMD capacitor)
FLT200  (10.7 MHz / 280kHz)  [Cerafil_10.7MHz_Filter]
FLT201  (10.7 MHz / 280kHz)  [Cerafil_10.7MHz_Filter]
L200  4uH7  [0805R]
L201  4.7uH  [WE-MI SMD Multilayer Inductor]
L202  4.7uH  [WE-MI SMD Multilayer Inductor]
NCD200  (no value)  [PCBComponent_1]
Q200  BFS17W  [SOT-323]
R200  10R  [0402RN]
R201  value 1kR  [R_SMD_0402]  (hidden comment: SMD Resistor)
R202  value 180R  [R_SMD_0402]  (hidden comment: SMD Resistor)
R203  value 100R  [R_SMD_0402]  (hidden comment: SMD Resistor)
R204  value 0R  [R_SMD_0402]  (hidden comment: SMD Resistor)
R205  value 5.6kR  [R_SMD_0402]  (hidden comment: SMD Resistor)
R206  value 5.6kR  [R_SMD_0402]  (hidden comment: SMD Resistor)
R207  4k7  [0402RN]
R208  value 3.3kR  [R_SMD_0402]  (hidden comment: SMD Resistor)
R209  value 33R  [R_SMD_0402]  (hidden comment: SMD Resistor)
R210  value 10kR  [R_SMD_0402]  (hidden comment: SMD Resistor)
R211  value 3.3kR  [R_SMD_0402]  (hidden comment: SMD Resistor)
R212  value 680R  [R_SMD_0402]  (hidden comment: SMD Resistor)
R213  value 470R  [R_SMD_0402]  (hidden comment: SMD Resistor)
R214  value 100R  [R_SMD_0402]  (hidden comment: SMD Resistor)
R215  value 1.5kR  [R_SMD_0402]  (hidden comment: SMD Resistor)
R216  value 100R  [R_SMD_0402]  (hidden comment: SMD Resistor)
U200  SA639  [TSSOP24]
U201  BGA2801  [SOT-363]
U202  LMV7219  [SOT-23-5]

### Ports
CAP_CLK, CAP_DAT, CAP_EN, FSK_AMP (bidir), FSK_DATA, FSK_LIM_OUT (bidir), FSK_RRSI (out), FSK_SHDN (in)

### Nets
3V3: BLM200.2 BLM201.2 C222.1 C223.1
COMP_3V3: BLM201.1 C217.2 C224.1 C225.1 R208.1 R211.1 R212.1 U202.5
FSK_3V3: BLM200.1 C218.2 C219.1 C220.1 NCD200.6(VDD) R200.2 U200.5(VCC)
GND: C200.2 C201.2 C202.1 C203.2 C204.2 C207.2 C208.1 C209.2 C212.2 C213.1 C215.2 C216.2 C217.1 C218.1 C219.2 C220.2 C222.2 C223.2 C224.2 C225.2 C226.2 FLT200.2 FLT201.2 L201.2 L202.2 NCD200.2(Vss) R201.2 R204.2 R207.1 R215.2 R216.2 U200.19(GND) U201.1 U201.2 U201.5 U202.2
CAP_CLK: NCD200.4(CLK) ; port CAP_CLK
CAP_DAT: NCD200.5(DA) ; port CAP_DAT
CAP_EN: NCD200.3(PV) ; port CAP_EN
FSK_DATA: R208.2 R209.1 ; port FSK_DATA
FSK_LIM: C210.1 R214.2 U200.15(LIM_OUT)
FSK_LIM_OUT: R213.2 ; port FSK_LIM_OUT
FSK_RRSI: C208.2 R203.2 ; port FSK_RRSI
FSK_SHDN: R204.1 U200.8(POW_DOW) ; port FSK_SHDN
IFQ_50: C205.2 ; port FSK_AMP
QUAD: C210.2 C211.2 C212.1 C213.2 L202.1 NCD200.1(X1)
NetC200_1: C200.1 C201.1 C202.2 L200.2 R200.1 U201.4(VCC)
NetC203_1: C203.1 U200.23(IF_DEC)
NetC204_1: C204.1 U200.21(IF_DEC)
NetC205_1: C205.1 U201.3
NetC206_1: C206.1 L200.1 U201.6
NetC206_2: C206.2 L201.1 R202.2
NetC207_1: C207.1 U200.17(LIM_DEC)
NetC209_1: C209.1 U200.16(LIM_DEC)
NetC211_1: C211.1 U200.14(QUAD_IN)
NetC214_1: C214.1 R205.2 R206.2
NetC214_2: C214.2 R210.2 U200.11(P_AMP_OUT) U202.3
NetC215_1: C215.1 R206.1 U200.10(P_AMP_IN)
NetC216_1: C216.1 R210.1 U202.4
NetC221_1: C221.1 R214.1
NetC221_2: C221.2 Q200.1(B) R211.2 R215.1
NetC226_1: C226.1 Q200.2(E) R216.1
NetFLT200_1: FLT200.1 U200.22(IF_IN)
NetFLT200_3: FLT200.3 R202.1
NetFLT201_1: FLT201.1 U200.18(LIM_IN)
NetFLT201_3: FLT201.3 U200.20(IF_OUT)
NetQ200_3: Q200.3(C) R212.2 R213.1
NetR201_1: R201.1 U200.4(XTAL_B)
NetR203_1: R203.1 U200.6(RSSI_FB) U200.7(RSSI_OUT)
NetR205_1: R205.1 U200.9(DATA_OUT)
NetR207_2: R207.2 U200.12(SW_C)
NetR209_2: R209.2 U202.1

Not connected (* = marked no-connect by the designer): U200 1(RF_IN) 2(RF_BP) 3(XTAL_E) 13(SW_OUT) 24(MIXER_OUT)

### Notes on the sheet
- (near R204) DNA
- programmable cap
- (in symbol ABA-32563) GND
- (in symbol FerriteBeat) 120

### Library data of the parts
BLM200 BLM201 = FerriteBeat: BLM18SG121TN1; Link: http://www.murata.com/en-us/api/pdfdownloadapi?cate=luNoiseSupprFilteChipFerriBead&partno=BLM18SG121TN1%23
C200 C201 C205 C206 = _C
C202 = 10u, 0603, 16V, X5R, 20%: MLCC, X5R, 16V, 20%, 0603; Libary Name: _CAP.Schlib; Hersteller: Murata; Bauteilenummer: GRM188R61C106MA73D; Bauteilalternative: with same specifications; Typ: Kondensator Keramik MDK; FIT: 2; Eingetragen von: MK; Part Number: 10u, 0603, 16V, X5R, 20%; Footprint Name: 0603R.PcbLib; Footprint: 0603; quantity Multiplier: 1; Source: SN29500-4, Tabelle 1; Distributor1: Digikey; Teilenummer Distributor1: 490-7201-1-ND; Preis @100 Distributor1: 0,1562
C203 C204 C207-C209 C217 C220 C225 C226 = C_SMD: 100nF, 0402, 6.3V, 10%, X5R; Type: X5R; Voltage Rate: *
C210 = C_SMD: 6.8pF, 0402, 6.3V, 10%, X5R; Type: X5R; Voltage Rate: *
C211 = C_SMD: 1nF, 0402, 6.3V, 10%, X5R; Type: X5R; Voltage Rate: *
C212 = TZC03R100A110
C213 = C_SMD: 28pF, 0402, 6.3V, 1%, X5R; Type: X5R; Voltage Rate: *
C214 = C_SMD: 100pF, 0402, 6.3V, 10%, X5R; Type: X5R; Voltage Rate: *
C215 = C_SMD: 39pF, 0402, 6.3V, 10%, X5R; Type: X5R; Voltage Rate: *
C216 C218 C221 = C_SMD: 10nF, 0402, 6.3V, 10%, X5R; Type: X5R; Voltage Rate: *
C219 C224 = C_SMD: 4.7uF, 0603, 6.3V, 10%, X5R; Type: X5R; Voltage Rate: *
C222 = 4u7, 1206, 16V, X7R: MLCC, 1206, X7R, 16V, 20%; Libary Name: _CAP.Schlib; Hersteller: TDK; Bauteilenummer: C3216X7R1C475M/1.60; Bauteilalternative: with same specifications; DatenblattLink intern: O:\literature\datasheets\tdk\kondensator\general_A11.pdf; Part Number: 4u7, 1206, 16V, X7R; Footprint Name: 1206R.PcbLib; Footprint: 1206; quantity Multiplier: 1; HelpURL: http://www.tdk.com/pdf/general_A11.pdf; DatenblattLink: http://www.tdk.com/pdf/general_A11.pdf; Distributor1: Digikey; Teilenummer Distributor1: 445-1425-1-ND; Preis @100 Distributor1: 0,1195; Distributor2: mouser; Teilenummer Distributor2: 810-C3216X7R1C475M-6; Preis @100 Distributor2: 0,112; Distributor3: Farnell; Teilenummer Distributor3: 1844320; Preis @100 Distributor3: 0,074
C223 = 10n, 0402, 50V, X7R: MLCC, X7R, 50V, 10%, 0402; Libary Name: _CAP.Schlib; Bauteilalternative: with same specifications; Part Number: 10n, 0402, 50V, X7R; Footprint Name: 0402RN.PcbLib; Footprint: 0402; quantity Multiplier: 1; Distributor1: Digikey; Preis @100 Distributor1: 0,0054
FLT200 FLT201 = CERAFIL_BP_10.7MHz: Murata SFECV10M7FA00-R0
L200 = _L: Wuerth WE MI; Wuerth Nr. 7447906
L201 L202 = 7447906_L_4u7: 7447906, WE Inductor; LINK: https://katalog.we-online.de/pbs/datasheet/7447906.pdf; Value: 4.7uH
NCD200 = NCD2100: NCD2100 Non-volatile Digital Programmable Capacitor SOT23-6; Hersteller: IXYS Integrated Circuits Division; Bauteilenummer: NCD2100TTR; Supplier 1: Digi-Key; Part Number: NCD2100; quantity Multiplier: 1; HelpURL: http://www.ixysic.com/home/pdfs.nsf/www/NCD2100.pdf/$file/NCD2100.pdf; DatenblattLink: http://www.ixysic.com/home/pdfs.nsf/www/NCD2100.pdf/$file/NCD2100.pdf; Distributor1: Digikey; Teilenummer Distributor1: CLA4162-2-ND; Preis @100 Distributor1: 1,66; Distributor2: Mouser; Teilenummer Distributor2: 849-NCD2100TTR; Preis @100 Distributor2: 1,39; Distributor3: -; Teilenummer Distributor3: -; Preis @100 Distributor3: 0
Q200 = BFS17W: BFS17WH6327XTSA1
R200 = _R
R201 = R_SMD: 1kR, 0402, 1%
R202 = R_SMD: 180R. 0402, 1%
R203 R214 R216 = R_SMD: 100R, 0402, 1%
R204 = R_SMD: 0R, 0402, 1%
R205 R206 = R_SMD: 5.6kR, 0402, 1%
R207 = 4k7, 0402, 1%, 0.063W, 50V: as R403 on sheet muC; Part Number: 4k7, 0402, 1%, 0.063W, 50V; Footprint Name: 0402RN.Pcblib; Footprint: 0402; quantity Multiplier: 1; Distributor1: Digikey; Preis @100 Distributor1: 0,0056
R208 R211 = R_SMD: 3.3kR, 0402, 1%
R209 = R_SMD: 33R, 0402, 1%
R210 = R_SMD: 10kR, 0402, 1%
R212 = R_SMD: 680R, 0402, 1%
R213 = R_SMD: 470R, 0402, 1%
R215 = R_SMD: 1.5kR, 0402, 1%
U200 = SA639: SA639DH/01,118
U201 = ABA-32563: NXP BGA2801
U202 = LMV7219: LMV7219M5

## Sheet CLK.SchDoc
size A3
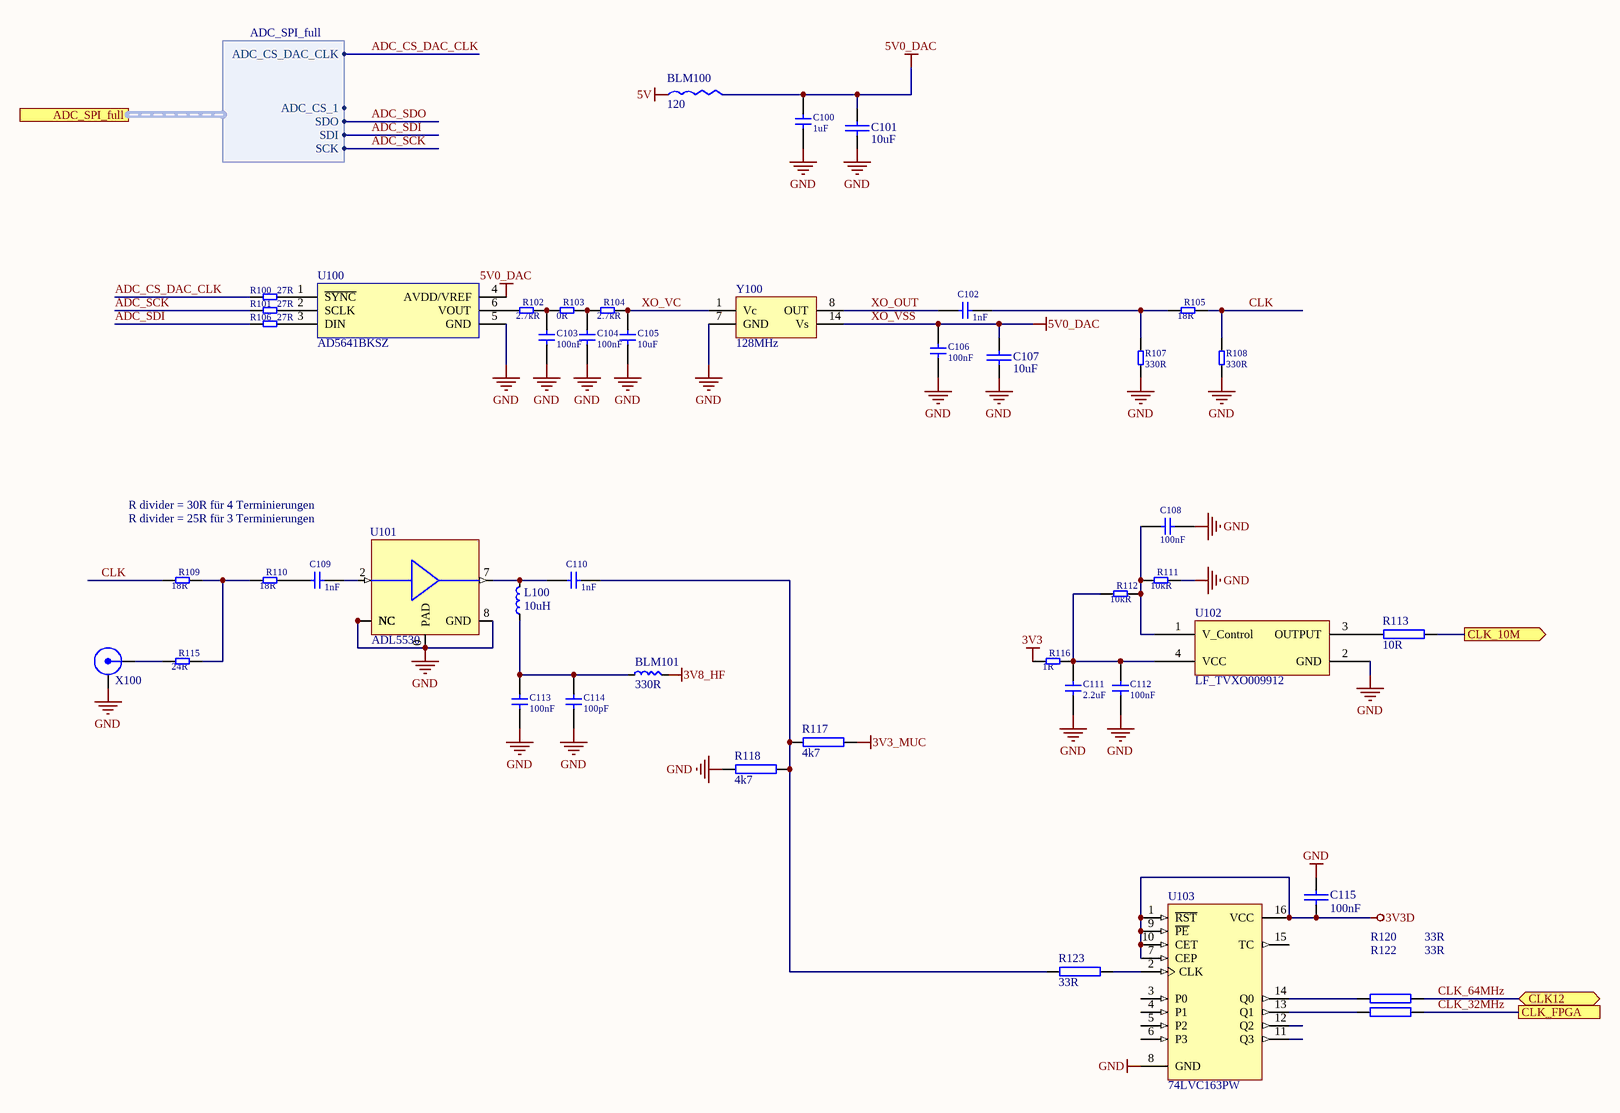
[diagram p6: CLK.SchDoc]

### Parts
BLM100  FerriteBeat  [BLM18SG121TN1]  (value not drawn)
BLM101  330R  [L_0805]
C100  value 1uF  [C_SMD_0603]  (hidden comment: SMD capacitor)
C101  10uF  [0603R]
C102  value 1nF  [C_SMD_0402]  (hidden comment: SMD capacitor)
C103  value 100nF  [C_SMD_0603]  (hidden comment: SMD capacitor)
C104  value 100nF  [C_SMD_0603]  (hidden comment: SMD capacitor)
C105  value 10uF  [C_SMD_1206]  (hidden comment: SMD capacitor)
C106  value 100nF  [C_SMD_0402]  (hidden comment: SMD capacitor)
C107  10uF  [0603R]
C108  value 100nF  [C_SMD_0603]  (hidden comment: SMD capacitor)
C109  value 1nF  [C_SMD_0402]  (hidden comment: SMD capacitor)
C110  value 1nF  [C_SMD_0402]  (hidden comment: SMD capacitor)
C111  value 2.2uF  [C_SMD_0603]  (hidden comment: SMD capacitor)
C112  value 100nF  [C_SMD_0603]  (hidden comment: SMD capacitor)
C113  value 100nF  [C_SMD_0402]  (hidden comment: SMD capacitor)
C114  value 100pF  [C_SMD_0402]  (hidden comment: SMD capacitor)
C115  100nF  [0402RN]
L100  10uH  [WE-MI SMD Multilayer Inductor]
R100  value 27R  [R_SMD_0402]  (hidden comment: SMD Resistor)
R101  value 27R  [R_SMD_0402]  (hidden comment: SMD Resistor)
R102  value 2.7kR  [R_SMD_0402]  (hidden comment: SMD Resistor)
R103  value 0R  [R_SMD_0402]  (hidden comment: SMD Resistor)
R104  value 2.7kR  [R_SMD_0402]  (hidden comment: SMD Resistor)
R105  value 18R  [R_SMD_0402]  (hidden comment: SMD Resistor)
R106  value 27R  [R_SMD_0402]  (hidden comment: SMD Resistor)
R107  value 330R  [R_SMD_0402]  (hidden comment: SMD Resistor)
R108  value 330R  [R_SMD_0402]  (hidden comment: SMD Resistor)
R109  value 18R  [R_SMD_0402]  (hidden comment: SMD Resistor)
R110  value 18R  [R_SMD_0402]  (hidden comment: SMD Resistor)
R111  value 10kR  [R_SMD_0402]  (hidden comment: SMD Resistor)
R112  value 10kR  [R_SMD_0402]  (hidden comment: SMD Resistor)
R113  10R  [0402RN]
R115  value 24R  [R_SMD_0402]  (hidden comment: SMD Resistor)
R116  value 1R  [R_SMD_0402]  (hidden comment: SMD Resistor)
R117  4k7  [0402RN]
R118  4k7  [0402RN]
R120  33R  [0402RN]
R122  33R  [0402RN]
R123  33R  [0402RN]
U100  AD5641BKSZ  [SC70-LT6_L]
U101  ADL5530  [LFCSP_CP-8-1]
U102  LF_TVXO009912  [CFPT-126]
U103  74LVC163PW  [TSSOP-16]
X100  U.FL-R-SMT  [U.FL-R-SMT(01)]  (value not drawn)
Y100  128MHz  [VX7-355S-15]

### Ports
ADC_SPI_full (harness ADC_SPI_full), CLK12 (bidir), CLK_10M (out), CLK_FPGA

### Harnesses
ADC_SPI_full: ADC_CS_1, SDO, SDI, SCK, ADC_CS_DAC_CLK

### Nets
3V3: R116.2
3V3_MUC: R117.2
3V3D: C115.2 U103.1(~{RST}) U103.7(CEP) U103.9(~{PE}) U103.10(CET) U103.16(VCC)
3V8_HF: BLM101.1
5V: BLM100.1
GND: C100.2 C101.2 C103.2 C104.2 C105.2 C106.2 C107.2 C108.2 C111.2 C112.2 C113.2 C114.2 C115.1 R107.2 R108.2 R111.1 R118.1 U100.5(GND) U101.0(PAD) U101.1(NC) U101.3(NC) U101.4(NC) U101.5(NC) U101.6(NC) U101.8(GND) U102.2(GND) U103.8(GND) X100.2 Y100.7(GND)
XO_VSS: BLM100.2 C100.1 C101.1 C106.1 C107.1 U100.4(AVDD/VREF) Y100.14(Vs)  [also labelled 5V0_DAC]
ADC_CS_DAC_CLK: R100.2 ; port ADC_SPI_full.ADC_CS_DAC_CLK
ADC_SCK: R101.2 ; port ADC_SPI_full.SCK
ADC_SDI: R106.2 ; port ADC_SPI_full.SDI
CLK: R105.1 R108.1 R109.2
CLK_10MHz: R113.2 ; port CLK_10M
CLK_32MHz: R122.2 ; port CLK_FPGA
CLK_64MHz: R120.2 ; port CLK12
XO_OUT: C102.1 Y100.8(OUT)
XO_VC: C105.1 R104.1 Y100.1(Vc)
NetBLM101_2: BLM101.2 C113.1 C114.1 L100.2
NetC102_2: C102.2 R105.2 R107.1
NetC103_1: C103.1 R102.1 R103.2
NetC104_1: C104.1 R103.1 R104.2
NetC108_1: C108.1 R111.2 R112.1 U102.1(V_Control)
NetC109_1: C109.1 R110.1
NetC109_2: C109.2 U101.2(IN)
NetC110_1: C110.1 L100.1 U101.7(OUT)
NetC110_2: C110.2 R117.1 R118.2 R123.1
NetC111_1: C111.1 C112.1 R112.2 R116.1 U102.4(VCC)
NetR100_1: R100.1 U100.1(~{SYNC})
NetR101_1: R101.1 U100.2(SCLK)
NetR102_2: R102.2 U100.6(VOUT)
NetR106_1: R106.1 U100.3(DIN)
NetR109_1: R109.1 R110.2 R115.1
NetR113_1: R113.1 U102.3(OUTPUT)
NetR115_2: R115.2 X100.1
NetR120_1: R120.1 U103.14(Q0)
NetR122_1: R122.1 U103.13(Q1)
NetR123_2: R123.2 U103.2(CLK)

Not connected (* = marked no-connect by the designer): U103 3(P0) 4(P1) 5(P2) 6(P3) 11(Q3) 12(Q2) 15(TC)

### Notes on the sheet
- R divider = 30R für 4 Terminierungen
- R divider = 25R für 3 Terminierungen
- (in symbol FerriteBeat) 120

### Library data of the parts
BLM100 = FerriteBeat: BLM18SG121TN1; Link: http://www.murata.com/en-us/api/pdfdownloadapi?cate=luNoiseSupprFilteChipFerriBead&partno=BLM18SG121TN1%23
BLM101 = MPZ2012S331AT000_BLM_330R: MPZ2012S331AT000
C100 = C_SMD: 1uF, 0603, 6.3V, 10%, X5R; Type: X5R; Voltage Rate: *
C101 C107 = 10u, 0603, 16V, X5R, 20%: as C202 on sheet FSK_Receiver; Part Number: 10u, 0603, 16V, X5R, 20%; Footprint Name: 0603R.PcbLib; Footprint: 0603; quantity Multiplier: 1; Source: SN29500-4, Tabelle 1; Distributor1: Digikey; Teilenummer Distributor1: 490-7201-1-ND; Preis @100 Distributor1: 0,1562
C102 C109 C110 = C_SMD: 1nF, 0402, 6.3V, 10%, X5R; Type: X5R; Voltage Rate: *
C103 C104 C108 C112 = C_SMD: 100nF, 0603, 50V, 10%, X5R; Type: X5R; Voltage Rate: *
C105 = C_SMD: 10uF, 1206, 50V, 20%, X5R; Type: X5R; Voltage Rate: *
C106 = C_SMD: 100nF, 0402, 6.3V, 10%, X5R; Type: X5R; Voltage Rate: *
C111 = C_SMD: 2.2uF, 0603, 6.3V, 10%, X5R; Type: X5R; Voltage Rate: *
C113 = C_SMD: 100nF, 0402 50V, 10%, X5R; Type: X5R; Voltage Rate: *
C114 = C_SMD: 100pF, 0402, 50V, 10%, C0G/NP0; Type: X5R; Voltage Rate: *
C115 = 100n, 0402, 50V, X7R: MLCC, X7R, 50V, 10%, 0402; Libary Name: _CAP.Schlib; Bauteilalternative: with same specifications; Part Number: 100n, 0402, 50V, X7R; Footprint Name: 0402RN.PcbLib; Footprint: 0402; quantity Multiplier: 1; Distributor1: Digikey; Preis @100 Distributor1: 0,0054
L100 = 7447908_L_10u: 7447908, WE Inductor
R100 R101 R106 = R_SMD: 27R, 0402, 1%
R102 R104 = R_SMD: 2.7kR, 0402, 1%
R103 = R_SMD: 0R, 0402, 1%
R105 R109 R110 = R_SMD: 18R, 0402, 1%
R107 R108 = R_SMD: 330R, 0402, 1%
R111 R112 = R_SMD: 10kR, 0402, 1%
R113 = 10R, 0402, 1%, 0.063W, 50V: 1%, 0.063W, 50V, 0402; Libary Name: _RES.Schlib; Part Number: 10R, 0402, 1%, 0.063W, 50V; Footprint Name: 0402RN.Pcblib; Footprint: 0402; quantity Multiplier: 1; Distributor1: Digikey; Preis @100 Distributor1: 0,0056
R115 = R_SMD: 24R, 0402, 1%
R116 = R_SMD: 1R, 0402, 1%
R117 R118 = 4k7, 0402, 1%, 0.063W, 50V: as R403 on sheet muC; Part Number: 4k7, 0402, 1%, 0.063W, 50V; Footprint Name: 0402RN.Pcblib; Footprint: 0402; quantity Multiplier: 1; Distributor1: Digikey; Preis @100 Distributor1: 0,0056
R120 R122 R123 = 33R, 0402, 1%, 0.063W, 50V: 1%, 0.063W, 50V, 0402; Libary Name: _RES.Schlib; Part Number: 33R, 0402, 1%, 0.063W, 50V; Footprint Name: 0402RN.Pcblib; Footprint: 0402; quantity Multiplier: 1; Distributor1: Digikey; Preis @100 Distributor1: 0,0056
U100 = DAC_AD5641BKSZ: DAC, 14bit, +-4LSB INL, SPI, SC70; Libary Name: TI-DAC.Schlib; Eingetragen von: MK; Hersteller: Analog Devices; Typ: IC, ASIC, CMOS, >=50 <=5k Transistoren; DatenblattLink intern: O:\literature\datasheets\analog_devices\ad_da converter\AD5641\AD5641.pdf; FIT: 20; Document SGS: 20150616-A_1D24; Part Number: DAC_AD5641BKSZ; Footprint Name: SC-70.PcbLib; Footprint: SC 70-6; Bauteilenummer: AD5641BKSZ; quantity Multiplier: 1; HelpURL: O:\literature\datasheets\analog_devices\ad_da converter\AD5641\AD5641.pdf; Source: SN29500-2, Tab. 5; Distributor1: digikey; Teilenummer Distributor1: AD5641BKSZ-500RL7CT-ND; Preis @100 Distributor1: 3,4758; Distributor2: Mouser; Teilenummer Distributor2: 584-AD5641BKSZ-500R7; Preis @100 Distributor2: 3,17; Distributor3: Farnell; Teilenummer Distributor3: 2376822; Preis @100 Distributor3: 2,03
U101 = ADL5530: IF Gain Block; DC-1GHz, 3-5 Volt; Libary Name: ANALOG_DEVICES.SchLib; Hersteller: Analog Devices; Bauteilenummer: ADL5530ACPZ-R7; Part Number: ADL5530; Footprint Name: analog_devices.PcbLib; quantity Multiplier: 1; DatenblattLink: http://www.analog.com/media/en/technical-documentation/data-sheets/ADL5530.pdf; Distributor1: Digikey; Teilenummer Distributor1: ADL5530ACPZ-R7CT-ND; Preis @100 Distributor1: 1,93; Distributor2: Mouser; Teilenummer Distributor2: 584-ADL5530ACPZ-R7; Preis @100 Distributor2: 1,66; Distributor3: Farnell; Teilenummer Distributor3: 2727624; Preis @100 Distributor3: 1,66
U103 = Counter - 74LVC163: Synchronous 4-bit binary conter; Libary Name: ON Semi Logic Conter.SchLib; Hersteller: NXP; Bauteilalternative: 74LVC163PW,118; Published: 15-Apr-2002; LatestRevisionDate: 13-Apr-2006; LatestRevisionNote: IPC-7351 Footprint Added.; DatasheetVersion: 9-Apr-1996; PackageVersion: Oct-1999; PackageReference: 751B-05; Publisher: Altium Limited; PackageDescription: 16-Pin Small Outline Integrated Circuit 1.27 mm Pitch; Code_JEDEC: MS-012-AC; Code_IPC: SOIC127P600-16; ComponentLink1Description: Manufacturer Link; ComponentLink1URL: http://www.onsemi.com/; ComponentLink2Description: Datasheet; ComponentLink2URL: http://www.onsemi.com/pub/Collateral/MC74AC161-D.PDF; Part Number: Counter - 74LVC163; Footprint Name: TSSOP-16.Pcblib; Bauteilenummer: 74LVC163PW; quantity Multiplier: 1; HelpURL: http://www.nxp.com/documents/data_sheet/74LVC163.pdf; Distributor1: Digikey; Teilenummer Distributor1: 568-2293-1-ND; Preis @100 Distributor1: 0,383; Distributor2: Mouser; Teilenummer Distributor2: 771-74LVC163PW-T; Preis @100 Distributor2: 0,376; Distributor3: Farnell; Teilenummer Distributor3: 2132711; Preis @100 Distributor3: 0,329
X100 = Connector - U.FL-R-SMT: U.FL Connector U.FL-R-SMT(01), 6GHz, 50R; Libary Name: BNC.Schlib; Hersteller: Hirose; Part Number: Connector - U.FL-R-SMT; Footprint Name: HIROSE_RF.PcbLib; Footprint: U.FL; Bauteilenummer: U.FL-R-SMT(01); quantity Multiplier: 1; HelpURL: http://www.hirose.co.jp/cataloge_hp/e32119372.pdf; DatenblattLink: http://www.hirose.co.jp/cataloge_hp/e32119372.pdf; Distributor3: farnell; Teilenummer Distributor3: 3908021; Preis @100 Distributor3: 0,806
Y100 = VX7-355S-15, 128MHz: VX7-355S-15 128MHz

## Nets that join several sheets
3V3: power (C513.1 U505.2), muC (BLM400.1), FSK_Receiver (BLM200.2 BLM201.2 C222.1 C223.1), CLK (R116.2)
3V3_MUC: muC (26 pins), USB (JTAG700.1 TTL700.4), CLK (R117.2)
3V8_HF: power (BLM503.1), interface (X300.b6 X300.b7), CLK (BLM101.1)
5V: power (BLM504.1 BLM505.2), CLK (BLM100.1)
5V_HF: power (BLM501.1 BLM502.2), interface (X300.a6 X300.a7)
GND: power (33 pins), interface (28 pins), muC (48 pins), USB (JTAG700.3 JTAG700.5 JTAG700.9 TTL700.1), FSK_Receiver (36 pins), CLK (29 pins)
ADC_CS_DAC_CLK: muC (U401.20), CLK (R100.2)
ADC_SCK: muC (U401.51), CLK (R101.2)
ADC_SDI: muC (U401.53), CLK (R106.2)
ANA_OUT: interface (X300.b17), muC (U401.15)
CAP_CLK: muC (U401.10), FSK_Receiver (NCD200.4)
CAP_DAT: muC (U401.8), FSK_Receiver (NCD200.5)
CAP_EN: muC (U401.9), FSK_Receiver (NCD200.3)
CLK_10MHz: muC (U401.14), CLK (R113.2)
CLK_32MHz: muC (U401.5), CLK (R122.2)
CLK_64MHz: interface (X300.b3), CLK (R120.2)
FSK_DATA: muC (R400.1 R401.2), FSK_Receiver (R208.2 R209.1)
FSK_LIM_OUT: muC (U401.26), FSK_Receiver (R213.2)
FSK_RRSI: muC (U401.22), FSK_Receiver (C208.2 R203.2)
FSK_SHDN: muC (U401.41), FSK_Receiver (R204.1 U200.8)
IFQ_50: interface (X300.a17), FSK_Receiver (C205.2)
IFQX_50: interface (X300.a18), muC (C414.1 L401.2)
JTAG_TCK: muC (U401.49), USB (JTAG700.4)
JTAG_TDI: muC (U401.50), USB (JTAG700.8)
JTAG_TDO: muC (U401.55), USB (JTAG700.6)
JTAG_TMS: muC (U401.46), USB (JTAG700.2)
MOSI_in: interface (X300.a8 X300.b8), muC (U401.23)
MTR_nCE: interface (X300.b9), muC (U401.11)
MUXOUT_buff: interface (X300.a11 X300.b11), muC (U401.16)
nSRST: muC (C413.1 U401.7), USB (JTAG700.10)
PLL_CE: interface (X300.a14), muC (U401.24)
PLL_LE: interface (X300.a13), muC (U401.17)
SCK_in: interface (X300.a10 X300.b10), muC (U401.21)
TR_EN: interface (X300.b18), muC (U401.57)
TX_DATA: interface (X300.a9), muC (U401.33)
UART_RXD: muC (U401.43), USB (TTL700.2)
UART_TXD: muC (U401.42), USB (TTL700.3)

## Assembly variants
basic: not fitted L1 R67 R71 R72